# EAGLE design WeatherShield_Base (EAGLE 7.3.0)
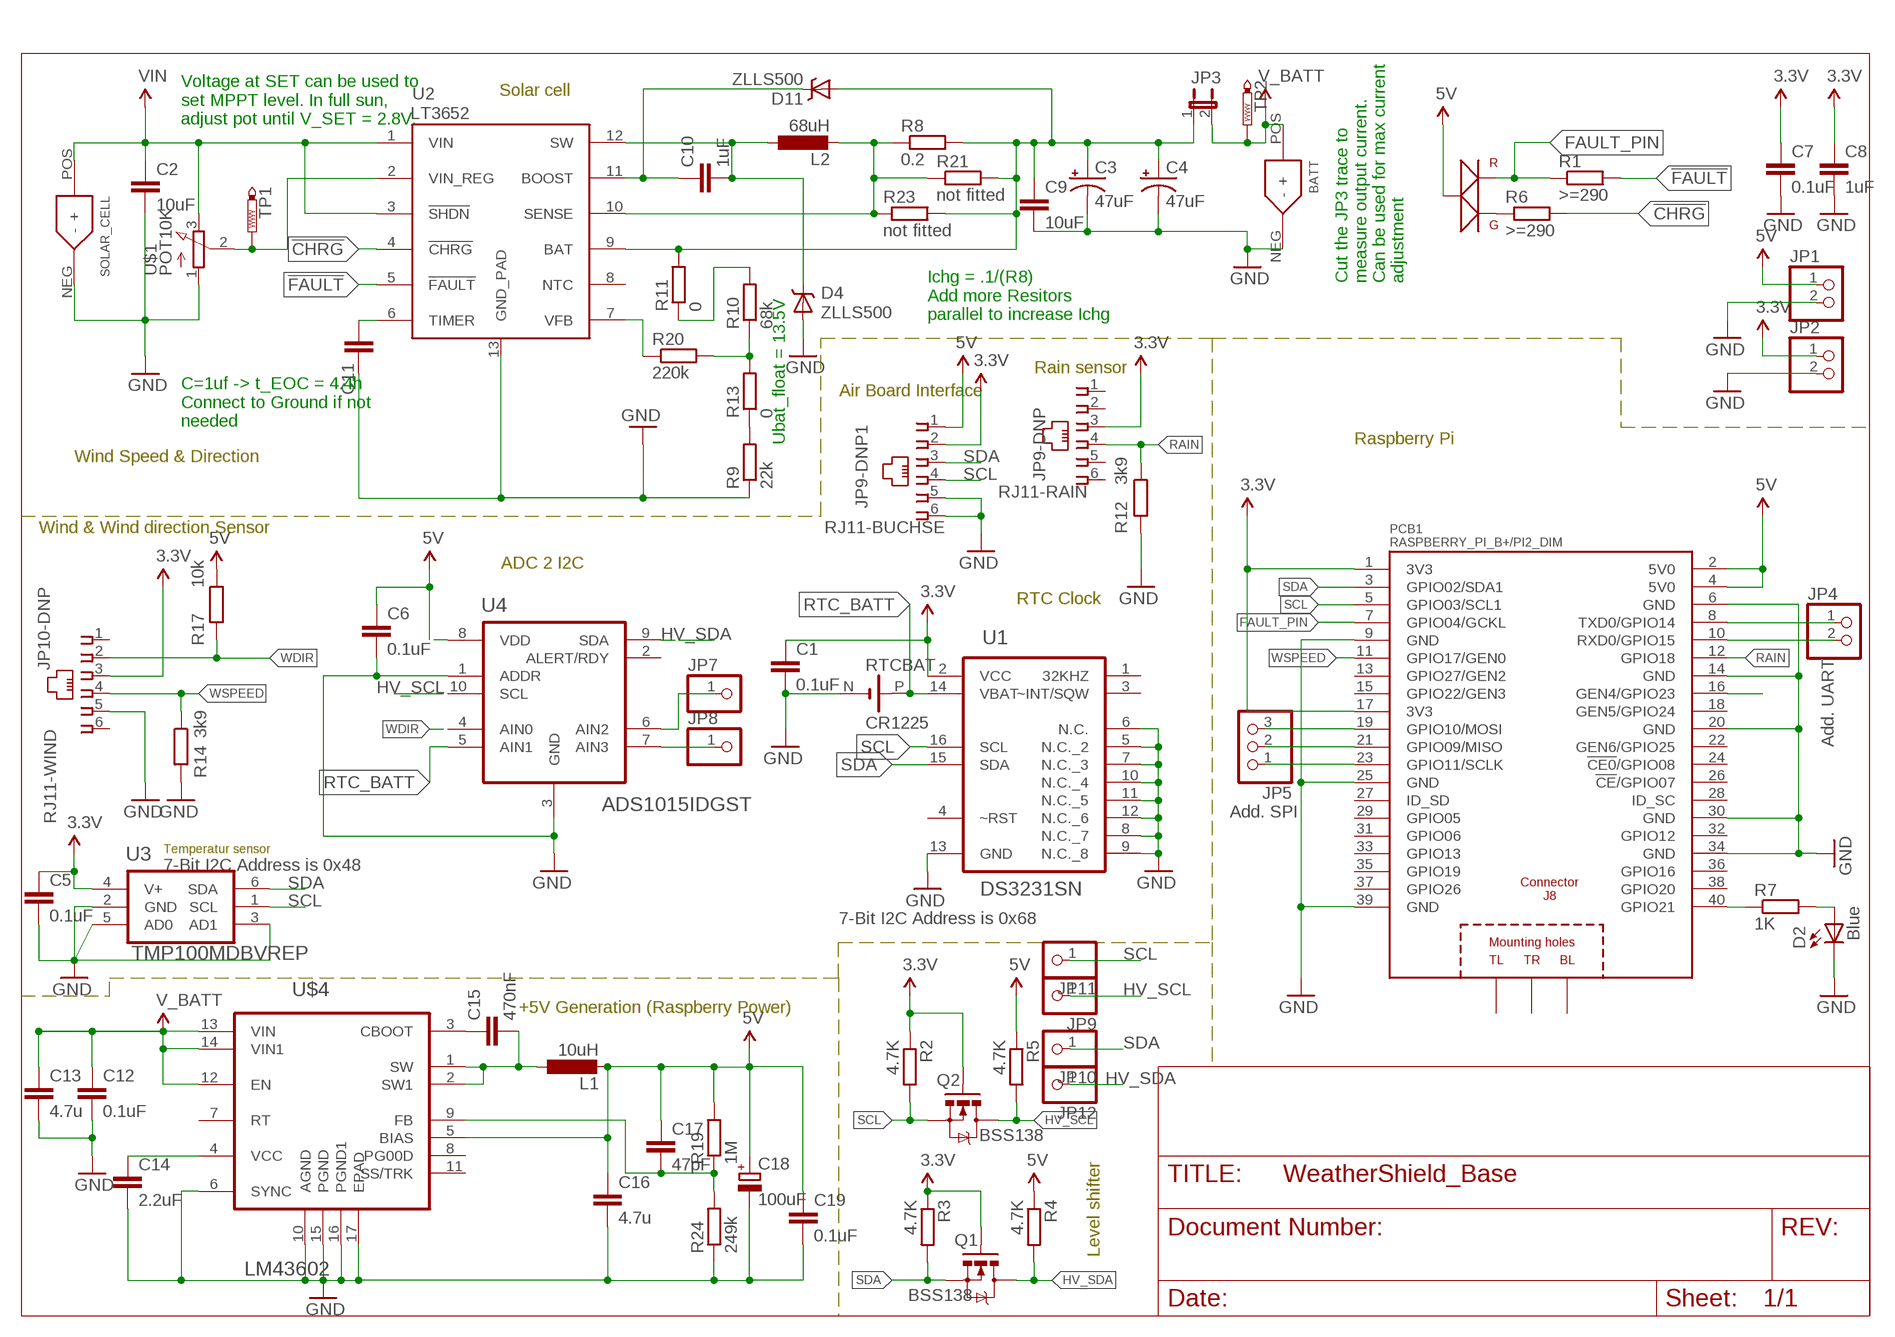
[diagram p0: schematic, sheet 1]

## Parts
BATT  XT-60  [XT-60]
C1  0.1uF  C-EUC0603  [C0603]
C2  10uF  C-EUC0603  [C0603]
C3  47uF  47UF-16V-10%(TANT)  [EIA7343-20]
C4  47uF  47UF-16V-10%(TANT)  [EIA7343-20]
C5  0.1uF  C-EUC0603  [C0603]
C6  0.1uF  C-EUC0603  [C0603]
C7  0.1uF  C-EUC0603  [C0603]
C8  1uF  C-EUC0603  [C0603]
C9  10uF  C-EUC0603  [C0603]
C10  1uF  C-EUC0603  [C0603]
C11  1.0uF  C-EUC0603  [C0603]
C12  0.1uF  C-EUC1206  [C1206]
C13  4.7u  C-EUC1206  [C1206]
C14  2.2uF  C-EUC0603  [C0603]
C15  470nF  C-EUC0603  [C0603]
C16  4.7u  C-EUC0603  [C0603]
C17  47pF  C-EUC0603  [C0603]
C18  100uF  CPOL-EUE2,5-6E  [E2,5-6E]
C19  0.1uF  C-EUC1206  [C1206]
D2  Blue  LED0603  [LED-0603]
D4  ZLLS500  ZLLS500ZLLS500  [SOT23]
D11  ZLLS500  ZLLS500ZLLS500  [SOT23]
JP1  PINHD-1X2  [1X02]
JP2  PINHD-1X2  [1X02]
JP3  JUMPER-PTH-2-NC  [PTH-JUMPER-NC_BOTTOM_NO_SILK]
JP4  PINHD-1X2  [1X02]
JP5  PINHD-1X3  [1X03]
JP7  PINHD-1X1  [1X01]
JP8  PINHD-1X1  [1X01]
JP9  PINHD-1X1  [1X01]
JP9-DNP  RJ11-RAIN  RJ11-BUCHSE  [RJ11-STECKER]
JP9-DNP1  RJ11-BUCHSE  [RJ11-STECKER]
JP10  PINHD-1X1  [1X01]
JP10-DNP  RJ11-WIND  RJ11-BUCHSE  [RJ11-STECKER]
JP11  PINHD-1X1  [1X01]
JP12  PINHD-1X1  [1X01]
L1  10uH  L-EU6000-XXX-RC  [6000-XXXX-RC]
L2  68uH  L-EU6000-XXX-RC  [6000-XXXX-RC]
PCB1  RASPBERRY_PI_B+/PI2_DIM  [RASPBERRY_PI_BPLUS_DIM]
Q1  BSS138  MOSFET-NCHANNELSMD  [SOT23-3]
Q2  BSS138  MOSFET-NCHANNELSMD  [SOT23-3]
R1  >=290  R-EU_R0603  [R0603]
R2  4.7K  R-EU_R0603  [R0603]
R3  4.7K  R-EU_R0603  [R0603]
R4  4.7K  R-EU_R0603  [R0603]
R5  4.7K  R-EU_R0603  [R0603]
R6  >=290  R-EU_R0603  [R0603]
R7  1K  R-EU_R0603  [R0603]
R8  0.2  R-EU_R0805  [R0805]
R9  22k  R-EU_R0603  [R0603]
R10  68k  R-EU_R0603  [R0603]
R11  0  R-EU_R0603  [R0603]
R12  3k9  R-EU_R0603  [R0603]
R13  0  R-EU_R0603  [R0603]
R14  3k9  R-EU_R0603  [R0603]
R17  10k  R-EU_R0603  [R0603]
R19  1M  R-EU_R0805  [R0805]
R20  220k  R-EU_R0603  [R0603]
R21  not fitted  R-EU_R0805  [R0805]
R23  not fitted  R-EU_R0805  [R0805]
R24  249k  R-EU_R0805  [R0805]
RTCBAT  CR1225  BATTERIE_HALTER_CR1225  [BATTERIE_HALTER_CR1225]
SOLAR_CELL  XT-60  [XT-60]
TP1  SET  PTR1B1,27  [B1,27]
TP2  SET  PTR1B1,27  [B1,27]
U1  DS3231SN  [SOIC127P1032X265-16N]
U2  LT3652  [MSOP-12_GND]
U3  TMP100MDBVREP  [SOT95P280X145-6N]
U4  ADS1015IDGST  [SOP50P490X110-10N]
U$1  POT10K  POT_TS63Y_10K  [POT_TS63Y_10K]
U$3  VLMV3100  [VLMV3100]
U$4  LM43602  [HTSSOP-16]

## Nets
3.3V: C1.1 C5.1 C7.1 C8.1 JP2.1 JP9-DNP1.2 JP9-DNP.3 JP10-DNP.3 PCB1.1(3V3) PCB1.17(3V3) Q1.1(G) Q2.1(G) R2.1 R3.1 U1.2(VCC) U3.4(V+)
5V: C6.1 C16.1 C17.1 C18.+ C19.1 JP1.1 JP9-DNP1.1 L1.2 PCB1.2(5V0) PCB1.4(5V0) R4.1 R5.1 R17.1 R19.2 U4.8(VDD) U$3.C U$4.5(BIAS)
!CHRG: R6.2 U2.4(!CHRG)
!FAULT: R1.2 U2.5(!FAULT)
BOOST: C10.1 D11.3(C) U2.11(BOOST)
FAULT_PIN: PCB1.7(GPIO04/GCKL) R1.1 U$3.A_RED
FB: R10.1 R13.2 R20.2
GND [vcc]: BATT.NEG(-) C1.2 C2.2 C3.C(-) C4.C(-) C5.2 C6.2 C7.2 C8.2 C9.2 C11.1 C12.2 C13.2 C14.2 C16.2 C18.- C19.2 D2.C D4.1(A) JP1.2 JP2.2 JP9-DNP1.5 JP9-DNP1.6 JP10-DNP.5 PCB1.6(GND) PCB1.9(GND) PCB1.14(GND) PCB1.20(GND) PCB1.25(GND) PCB1.30(GND) PCB1.34(GND) PCB1.39(GND) R9.1 R12.2 R14.2 R24.1 RTCBAT.N(-) SOLAR_CELL.NEG(-) U1.5(N.C._2) U1.6(N.C.) U1.7(N.C._3) U1.8(N.C._7) U1.9(N.C._8) U1.10(N.C._4) U1.11(N.C._5) U1.12(N.C._6) U1.13(GND) U2.13(GND_PAD) U3.2(GND) U3.3(AD1) U3.5(AD0) U4.1(ADDR) U4.3(GND) U$1.1(A) U$4.6(SYNC) U$4.10(AGND) U$4.15(PGND) U$4.16(PGND1) U$4.17(EPAD)
HV_SCL: JP9.1 Q2.3(D) R5.2 U4.10(SCL)
HV_SDA: JP12.1 Q1.3(D) R4.2 U4.9(SDA)
N$1: R9.2 R13.1
N$2: R10.2 R11.1
N$3: PCB1.16(GEN4/GPIO23)
N$4: R6.1 U$3.A_GREEN
N$8: JP7.1 U4.6(AIN2)
N$9: JP8.1 U4.7(AIN3)
N$10: D2.A R7.2
N$15: R20.1 U2.7(VFB)
N$16: C3.A(+) C4.A(+) C9.1 D11.1(A) JP3.1 R8.2 R11.2 R21.2 R23.2 U2.9(BAT)
N$17: C15.1 U$4.3(CBOOT)
N$18: JP4.1 PCB1.8(TXD0/GPIO14)
N$19: JP4.2 PCB1.10(RXD0/GPIO15)
N$20: JP5.3 PCB1.19(GPIO10/MOSI)
N$21: JP5.2 PCB1.21(GPIO09/MISO)
N$22: C17.2 R19.1 R24.2 U$4.9(FB)
N$23: C14.1 U$4.4(VCC)
N$24: C15.2 L1.1 U$4.1(SW) U$4.2(SW1)
N$25: JP5.1 PCB1.23(GPIO11/SCLK)
RAIN: JP9-DNP.4 PCB1.12(GPIO18) R12.1
RTC_BATT: RTCBAT.P(+) U1.14(VBAT) U4.5(AIN1)
SCL: JP9-DNP1.4 JP11.1 PCB1.5(GPIO03/SCL1) Q2.2(S) R2.2 U1.16(SCL) U3.1(SCL)
SDA: JP9-DNP1.3 JP10.1 PCB1.3(GPIO02/SDA1) Q1.2(S) R3.2 U1.15(SDA) U3.6(SDA)
SENSE: L2.2 R8.1 R21.1 R23.1 U2.10(SENSE)
SET: TP1.TP U2.2(VIN_REG) U$1.2(S)
STAT3: PCB1.40(GPIO21) R7.1
SW: C10.2 D4.3(C) L2.1 U2.12(SW)
TIMER: C11.2 U2.6(TIMER)
V_BATT: BATT.POS(+) C12.1 C13.1 JP3.2 TP2.TP U$4.12(EN) U$4.13(VIN) U$4.14(VIN1)
VIN: C2.1 SOLAR_CELL.POS(+) U2.1(VIN) U2.3(!SHDN) U$1.3(E)
WDIR: JP10-DNP.2 R17.2 U4.4(AIN0)
WSPEED: JP10-DNP.4 PCB1.11(GPIO17/GEN0) R14.1
Unconnected: JP9-DNP.1 JP9-DNP.2 JP9-DNP.5 JP9-DNP.6 JP10-DNP.1 JP10-DNP.6 PCB1.13(GPIO27/GEN2) PCB1.15(GPIO22/GEN3) PCB1.18(GEN5/GPIO24) PCB1.22(GEN6/GPIO25) PCB1.24(!CE0!/GPIO08) PCB1.26(!CE!/GPIO07) PCB1.27(ID_SD) PCB1.28(ID_SC) PCB1.29(GPIO05) PCB1.31(GPIO06) PCB1.32(GPIO12) PCB1.33(GPIO13) PCB1.35(GPIO19) PCB1.36(GPIO16) PCB1.37(GPIO26) PCB1.38(GPIO20) PCB1.PE_BL(BL) PCB1.PE_TL(TL) PCB1.PE_TR(TR) U1.1(32KHZ) U1.3(~INT/SQW) U1.4(~RST) U2.8(NTC) U4.2(ALERT/RDY) U$4.7(RT) U$4.8(PG00D) U$4.11(SS/TRK)

## Notes on the sheet
- Solar cell
- Voltage at SET can be used to
  set MPPT level. In full sun,
  adjust pot until V_SET = 2.8V.
- Cut the JP3 trace to
  measure output current.
  Can be used for max current
  adjustment
- Ichg = .1/(R8)
  Add more Resitors 
  parallel to increase Ichg
- Rain sensor
- Air Board Interface
- C=1uf -> t_EOC = 4.4h
  Connect to Ground if not 
  needed
- Ubat_float = 13.5V | Raspberry Pi
- Wind Speed & Direction
- Wind & Wind direction Sensor
- ADC 2 I2C
- RTC Clock
- Add. UART
- Add. SPI
- Temperatur sensor
- 7-Bit I2C Address is 0x48
- 7-Bit I2C Address is 0x68
- +5V Generation (Raspberry Power)
- Level shifter

## Library data of the parts
BATT SOLAR_CELL = FSEWeatherShield:XT-60
C1 C2 C5-C17 C19 = rcl:C-EU: CAPACITOR, European symbol
C3 C4 = FSEWeatherShield:47UF-16V-10%(TANT)
C18 = rcl:CPOL-EU: POLARIZED CAPACITOR, European symbol
D2 = SparkFun:LED: LEDs Standard schematic elements and footprints for 5mm, 3mm, 1206, and 0603 sized LEDs. 5mm - Spark Fun Electronics SKU : COM-00529 (and others)
D4 D11 = SparkFun-DiscreteSemi:ZLLS500: 700mA 40V SOT-23 Schottky; PROD_ID: DIO-08411
JP1 JP2 JP4 = pinhead:PINHD-1X2: PIN HEADER
JP3 = SparkFun-Passives:JUMPER-PTH-2-NC
JP5 = pinhead:PINHD-1X3: PIN HEADER
JP7-JP12 = pinhead:PINHD-1X1: PIN HEADER
JP9-DNP JP9-DNP1 JP10-DNP = FSEWeatherShield:RJ11-BUCHSE
L1 L2 = rcl:L-EU: INDUCTOR, European symbol
PCB1 = FSE_Weather_Shield:RASPBERRY_PI_B+/PI2: Raspberry Pi B+ Basedon issue: Thursday, July 10, 2014 - Rev 1.2 LBR by Tim Rettmann 07-2014
Q1 Q2 = SparkFun:MOSFET-NCHANNEL
R1-R14 R17 R19-R21 R23 R24 = rcl:R-EU_: RESISTOR, European symbol
RTCBAT = FSEWeatherShield:BATTERIE_HALTER_CR1225
TP1 TP2 = testpad:PTR1: TEST PIN
U1 = FSE_Weather_Shield:DS3231SN: Extremely Accurate I2C-Integrated RTC/TCXO/Crystal; MPN: DS3231SN#; OC_FARNELL: 1593292; OC_NEWARK: 68K3406; PACKAGE: SOIC-16; SUPPLIER: Maxim
U2 = SparkFun-PowerIC:LT3652: LT3652 MPPT Solar Charge Controller 5V-32V smart charger for batteries up to 14.4V
U3 = FSEWeatherShield:TMP100MDBVREP: DIGITAL TEMPERATURE SENSOR WITH I2C INTERFACE; MPN: TMP100MDBVREP; OC_FARNELL: 1715202; OC_NEWARK: 46M1069; PACKAGE: SOT-23-6; SUPPLIER: Texas Instruments
U4 = FSEWeatherShield:ADS1015IDGST: Ultra-Small, Low-Power, 12-Bit Analog-to-Digital Converter with Internal Reference; MPN: ADS1015IDGST; OC_FARNELL: 1778211; OC_NEWARK: 35R0211; PACKAGE: MSOP-10; SUPPLIER: Texas Instruments
U$1 = FSEWeatherShield:POT_TS63Y_10K
U$3 = FSEWeatherShield:VLMV3100
U$4 = FSEWeatherShield:LM43602

## Net classes
1 vcc: width 0.203 mm

## Board
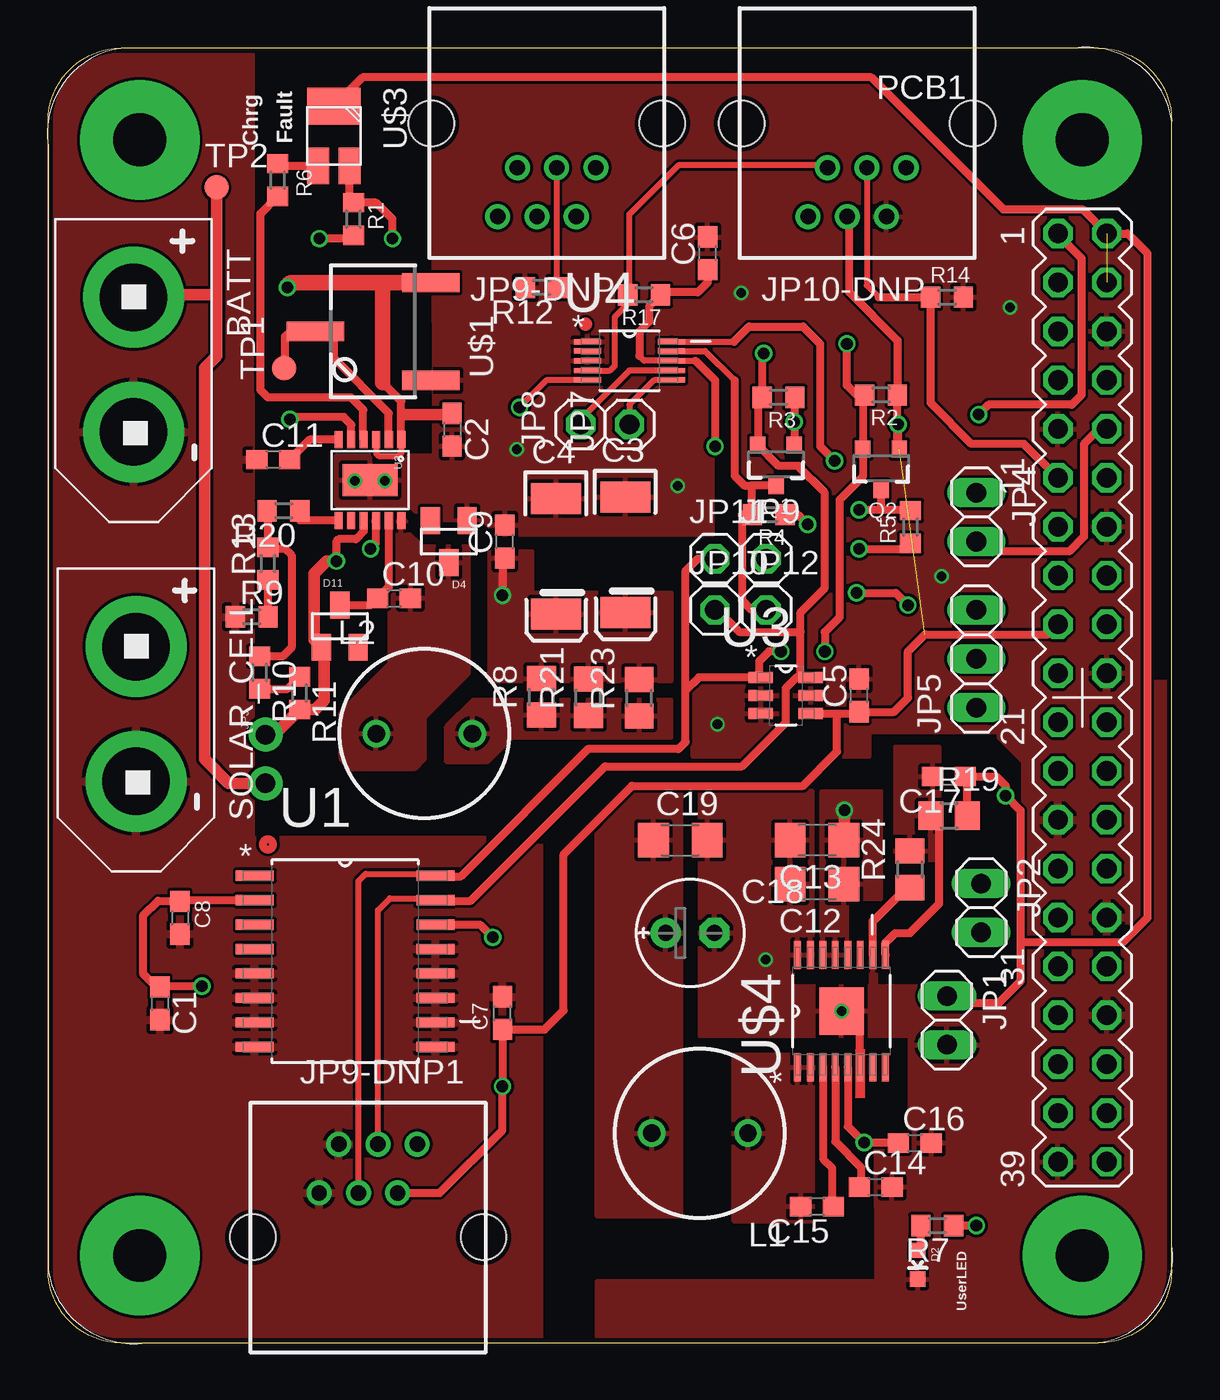
[diagram p1: board, top side]
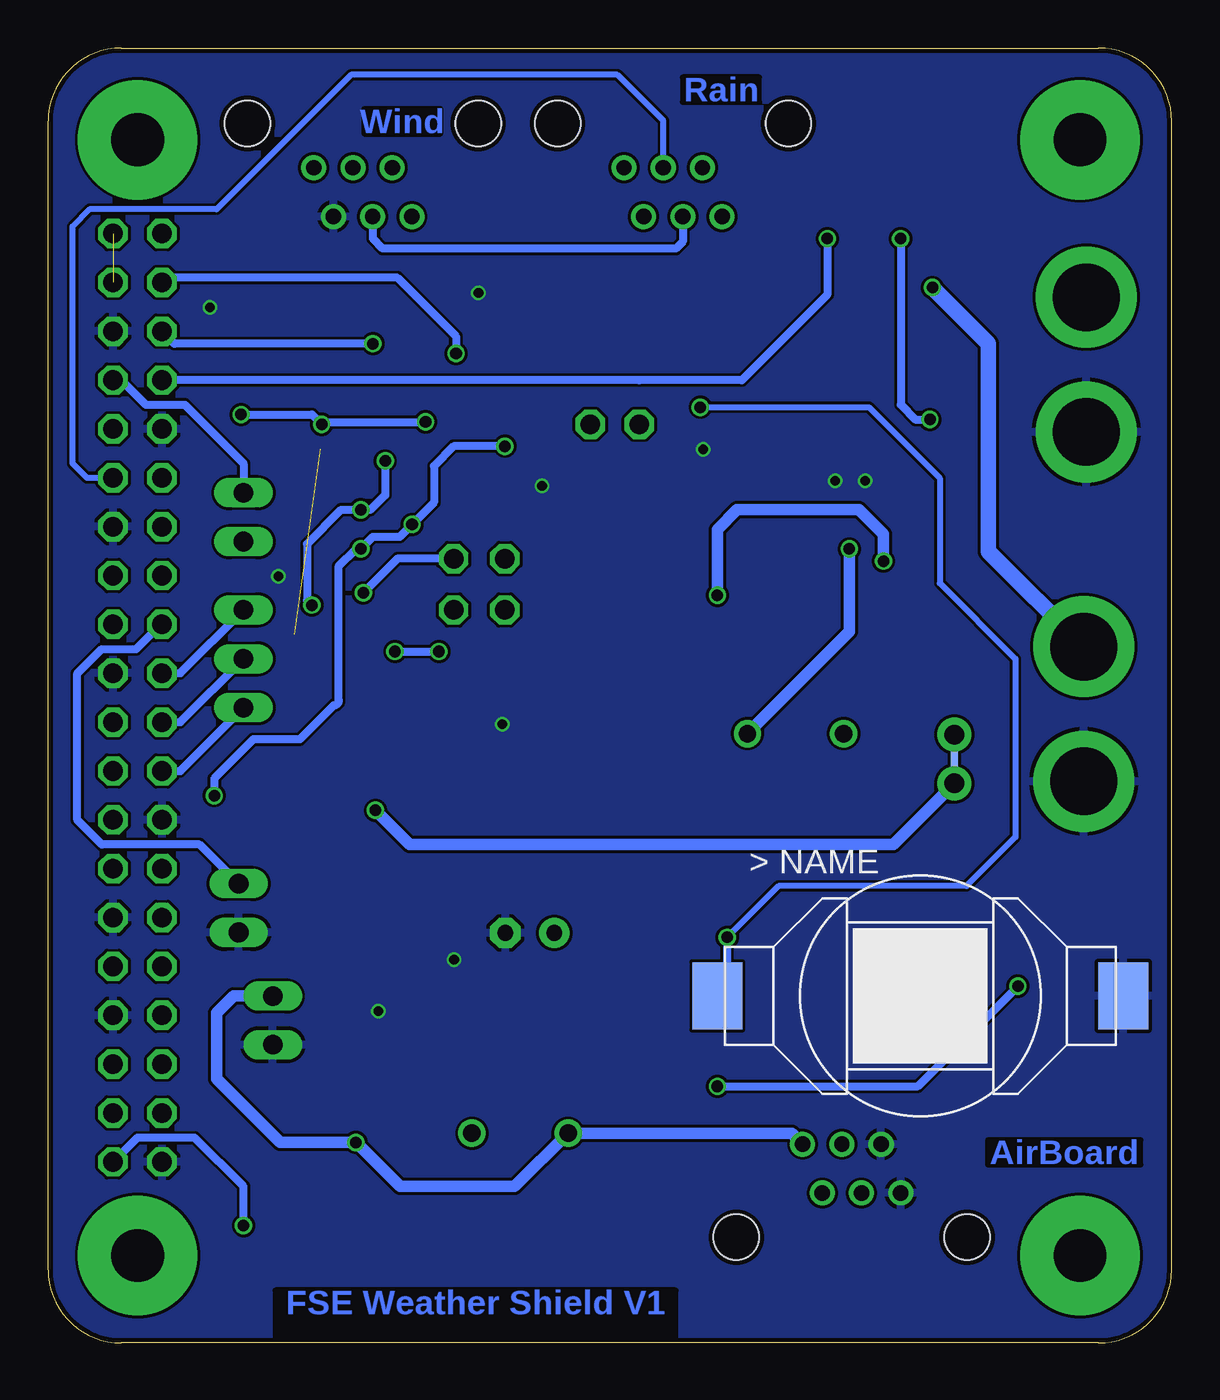
[diagram p2: board, bottom side, seen from below]

Size 58.42 x 67.31 mm. Coordinates in mm from the lower left corner, seen from the top.
Outline: 54.61,67.31 arc-90 58.42,63.5 58.42,3.81 arc-90 54.61,0 3.81,0 arc-90 0,3.81 0,63.5 arc-90 3.81,67.31 54.61,67.31
Copper layers (1*16): Top 0.018mm / dielectric 1.55mm / Bottom 0.018mm
Design rules "eC_2Layer_PClass6_BaseCopperO18_eCDefault": minimum track width 0.15mm, minimum drill 0.35mm, track to track 0.15mm, track to pad 0.15mm, pad to pad 0.15mm, via to via 0.15mm, smd to smd 0mil, copper to edge 0.25mm, drill to drill 0.35mm, minimum pad ring 0.175mm, minimum via ring 0.125mm, stop-mask expansion 0mil, vias tented up to drill 0.45mm, thermal gap 0.2mm

### Footprints (pad centres in the part's own frame; a part is rotated, then mirrored left to right if it is on the bottom)
XT-60 = drill 3.5: NEG 7,0; POS 0,0
C0603 = smd 1.1 x 1: 1 -0.85,0; 2 0.85,0
EIA7343-20 = smd 1.6 x 2.6: A 3,0; C -3,0
C1206 = smd 1.6 x 1.8: 1 -1.4,0; 2 1.4,0
E2,5-6E = drill 0.813 pad 1.575: + -1.27,0 | drill 0.813 pad 1.575 octagon: - 1.27,0
LED-0603 = smd 0.8 x 0.8: A 0,-0.75; C 0,0.75
SOT23 = smd 1 x 1.4: 1 -0.95,-1.1; 2 0.95,-1.1; 3 0,1.1
1X02 = drill 1.016 long: 1 -1.27,0; 2 1.27,0
PTH-JUMPER-NC_BOTTOM_NO_SILK = drill 1.016 pad 1.778: 1 -1.27,0; 2 1.27,0 | smd 1.27 x 0.381 bottom: P$1 0,0
1X03 = drill 1.016 long: 1 -2.54,0; 2 0,0; 3 2.54,0
1X01 = drill 1.016 octagon: 1 0,0
RJ11-STECKER = drill 0.8 pad 1.3: 1 8.65,10.84; 2 7.63,8.3; 3 6.61,10.84; 4 5.59,8.3; 5 4.57,10.84; 6 3.55,8.3 | hole 2.36: 0.1,6; 12.1,6
6000-XXXX-RC = drill 0.9 pad 1.422: 1 -2.5,0; 2 2.5,0
RASPBERRY_PI_BPLUS_DIM = drill 1.016 octagon: 1 9.64,52.5; 2 9.64,55.04; 3 12.18,52.5; 4 12.18,55.04; 5 14.72,52.5; 6 14.72,55.04; 7 17.26,52.5; 8 17.26,55.04; 9 19.8,52.5; 10 19.8,55.04; 11 22.34,52.5; 12 22.34,55.04; 13 24.88,52.5; 14 24.88,55.04; 15 27.42,52.5; 16 27.42,55.04; 17 29.96,52.5; 18 29.96,55.04; 19 32.5,52.5; 20 32.5,55.04; 21 35.04,52.5; 22 35.04,55.04; 23 37.58,52.5; 24 37.58,55.04; 25 40.12,52.5; 26 40.12,55.04; 27 42.66,52.5; 28 42.66,55.04; 29 45.2,52.5; 30 45.2,55.04; 31 47.74,52.5; 32 47.74,55.04; 33 50.28,52.5; 34 50.28,55.04; 35 52.82,52.5; 36 52.82,55.04; 37 55.36,52.5; 38 55.36,55.04; 39 57.9,52.5; 40 57.9,55.04 | drill 2.75 pad 6.2: PE_BL 4.77,4.77; PE_TL 4.77,53.77; PE_TR 62.77,53.77; PE_TR1 62.77,4.77
SOT23-3 = smd 0.8 x 0.9: 1 -0.95,-1; 2 0.95,-1; 3 0,1.1
R0603 = smd 1 x 1.1: 1 -0.85,0; 2 0.85,0
R0805 = smd 1.3 x 1.5: 1 -0.95,0; 2 0.95,0
BATTERIE_HALTER_CR1225 = smd 2.6 x 3.5: N 10.55,0; P -10.55,0
B1,27 = smd 1.27 x 1.27: TP 0,0
SOIC127P1032X265-16N = smd 1.981 x 0.533: 1 -4.699,4.445; 2 -4.699,3.175; 3 -4.699,1.905; 4 -4.699,0.635; 5 -4.699,-0.635; 6 -4.699,-1.905; 7 -4.699,-3.175; 8 -4.699,-4.445; 9 4.699,-4.445; 10 4.699,-3.175; 11 4.699,-1.905; 12 4.699,-0.635; 13 4.699,0.635; 14 4.699,1.905; 15 4.699,3.175; 16 4.699,4.445
MSOP-12_GND = smd 0.889 x 0.42: 1 -2.1,1.625; 2 -2.1,0.975; 3 -2.1,0.325; 4 -2.1,-0.325; 5 -2.1,-0.975; 6 -2.1,-1.625; 7 2.1,-1.625; 8 2.1,-0.975; 9 2.1,-0.325; 10 2.1,0.325; 11 2.1,0.975; 12 2.1,1.625 | smd 1.651 x 2.845: 13 0,0
SOT95P280X145-6N = smd 1.27 x 0.559: 1 -1.295,0.94; 2 -1.295,0; 3 -1.295,-0.94; 4 1.295,-0.94; 5 1.295,0; 6 1.295,0.94
SOP50P490X110-10N = smd 1.422 x 0.279: 1 -2.184,0.991; 2 -2.184,0.508; 3 -2.184,0; 4 -2.184,-0.508; 5 -2.184,-0.991; 6 2.184,-0.991; 7 2.184,-0.508; 8 2.184,0; 9 2.184,0.508; 10 2.184,0.991
POT_TS63Y_10K = smd 3 x 1: 1 3,-2.54; 2 -3,0; 3 3,2.54
VLMV3100 = smd 1.9 x 1.15: A_GREEN 1.55,-0.825; A_RED 1.55,0.825 | smd 1.9 x 2.8: C -1.55,0
HTSSOP-16 = smd 1.473 x 0.356: 1 -2.921,2.286; 2 -2.921,1.626; 3 -2.921,0.965; 4 -2.921,0.33; 5 -2.921,-0.33; 6 -2.921,-0.965; 7 -2.921,-1.626; 8 -2.921,-2.286; 9 2.921,-2.286; 10 2.921,-1.626; 11 2.921,-0.965; 12 2.921,-0.33; 13 2.921,0.33; 14 2.921,0.965; 15 2.921,1.626; 16 2.921,2.286 | smd 2.464 x 2.311: 17 0,0

### Placement (x,y rotation side)
BATT  4.45,54.36 270 top
C1  5.82,17.65 270 top
C2  21.01,47.47 270 top
C3  30.02,40.97 270 top
C4  26.42,40.89 270 top
C5  42.16,33.66 90 top
C6  34.29,56.64 90 top
C7  23.62,17.15 90 top
C8  6.86,22.1 270 top
C9  23.75,41.66 90 top
C10  17.98,38.71 0 top
C11  11.71,45.92 0 top
C12  39.98,23.85 180 top
C13  39.98,26.14 180 top
C14  43.03,8.1 0 top
C15  39.98,7.09 180 top
C16  45.06,10.39 0 top
C17  46.84,29.44 180 top
C18  33.38,21.31 0 top
C19  32.87,26.14 0 top
D2  45.21,4.06 180 top
D4  20.83,41.66 180 top
D11  15.16,37.26 0 top
JP1  46.74,16.76 270 top
JP2  48.51,22.61 270 top
JP3  11.3,30.35 270 top
JP4  48.26,42.93 270 top
JP5  48.26,35.56 90 top
JP7  30.23,47.75 90 top
JP8  27.69,47.75 90 top
JP9  37.34,40.77 0 top
JP9-DNP  32.03,69.39 180 top
JP9-DNP1  10.54,-0.51 0 top
JP10  34.67,38.1 0 top
JP10-DNP  48.16,69.39 180 top
JP11  34.67,40.77 0 top
JP12  37.34,38.1 0 top
L1  33.88,10.9 180 top
L2  19.56,31.67 0 top
PCB1  0,67.31 270 top
Q1  37.85,45.67 180 top
Q2  43.31,45.47 180 top
R1  15.88,58.42 270 top
R2  43.31,49.28 180 top
R3  37.97,49.15 180 top
R4  37.46,43.05 180 top
R5  44.83,42.42 90 top
R6  11.94,60.45 270 top
R7  46.23,6.1 180 top
R8  25.65,33.58 90 top
R9  10.59,37.74 0 top
R10  11,34.85 270 top
R11  13.08,33.78 270 top
R12  25.65,54.86 180 top
R13  11.43,40.51 90 top
R14  46.74,54.36 0 top
R17  30.99,54.48 180 top
R19  46.84,27.41 0 top
R20  12.24,43.26 180 top
R21  28.09,33.55 90 top
R23  30.73,33.53 90 top
R24  44.81,24.61 90 top
RTCBAT  13.08,18.03 0 bottom
SOLAR_CELL  4.57,36.2 270 top
TP1  12.27,50.67 90 top
TP2  8.76,60.07 0 top
U1  15.44,19.84 0 top
U2  16.74,44.86 270 top
U3  38.35,33.66 0 top
U4  30.23,51.05 0 top
U$1  16.89,52.58 0 top
U$3  14.86,62.74 270 top
U$4  41.25,17.25 90 top

### Tracks (layer width: path | path; a pad name or v marks a point on that pad's centre or on a via)
3.3V  (via drill 0.6)  (1 unrouted)
  Top 0.406: R3.1 38.8,49.12 v38.8,47.88 Q1.1 | v44.2,47.75 44.2,46.65 Q2.1 44.16,46.69 R2.1 44.16,52.11 41.66,54.61 41.66,58.45 JP10-DNP.3 41.53,58.53 | U3.4 41.02,32.72 | 41.02,32.72 42.07,32.72 C5.1 43.98,32.8 44.7,33.53 44.7,35.94 45.59,36.83 51.98,36.83 PCB1.17 | 41.02,32.72 41.02,30.73 39.24,28.96 30.35,28.96 26.8,25.4 26.8,17.27 25.82,16.3 C7.1 v23.62,13.34 23.62,11.05 20.36,7.79 JP9-DNP1.2 | U1.2 6.86,23.01 C8.1 6.82,22.99 5.71,22.99 4.95,22.23 4.95,19.18 5.63,18.5 C1.1 5.86,18.54 v8,18.54 | PCB1.1 52.5,57.61 53.72,56.39 53.72,49.28 53.21,48.77 48.89,48.77 v48.39,48.26
  Bottom 0.406: JP2.1 50.55,25.91 55.63,25.91 56.9,27.18 56.9,34.8 55.63,36.07 53.85,36.07 52.57,37.35 PCB1.17 | v38.8,47.88 44.07,47.88 v44.2,47.75 44.7,48.26 v48.39,48.26 | v23.62,13.34 13.21,13.34 v8,18.54 | JP9-DNP.3 25.42,57.26 25.78,56.9 41.02,56.9 41.53,57.4 41.53,58.53 JP10-DNP.3
5V  (via drill 0.6)  (1 unrouted)
  Top 0.305: 30.73,51.31 30.99,51.05 U4.8 33.66,51.05
  Top 0.406: R19.2 47.79,29.34 C17.1 49.3,29.44 49.78,28.96 v49.78,28.45 50.55,27.69 50.55,20.83 | U$4.5 41.58,11.25 v42.42,10.41 44.18,10.41 C16.1 | 50.55,20.83 50.55,18.8 49.4,17.65 47.12,17.65 JP1.1 | 50.55,20.83 55.88,20.83 57.15,22.1 57.15,56.64 56.12,57.67 PCB1.2 53.78,58.93 49.66,58.93 42.8,65.79 16.36,65.79 U$3.C | C6.1 34.29,55.12 33.78,54.61 31.96,54.61 R17.1 31.24,53.89 31.24,53.09 30.73,52.58 30.73,51.31 | 33.66,51.05 34.67,50.04 v34.67,46.61 | R4.1 38.99,43.05 v39.5,42.55 | v42.16,41.27 44.54,41.27 R5.1
  Bottom 0.406: 31.5,10.78 L1.2 | v49.78,28.45 49.78,29.34 47.75,31.37 45.34,31.37 43.56,33.15 arc-90 43.31,33.4 43.31,40.39 42.42,41.27 v42.16,41.27 41.53,41.91 40.13,41.91 v39.5,42.55 38.35,43.69 38.35,45.59 37.34,46.61 v34.67,46.61
  Bottom 0.61: JP9-DNP1.1 19.76,10.9 L1.2 34.16,8.13 40.13,8.13 v42.42,10.41 46.35,10.41 49.66,13.72 49.66,17.15 48.77,18.03 JP1.1
  pour Top: 32.87,28.68 32.87,6.58 28.55,6.58 28.55,28.68
!CHRG
  Top 0.406: U2.4 16.38,46.99 16.38,48.51 15.75,49.15 11.43,49.15 11.05,49.53 11.05,58.71 R6.2
!FAULT  (via drill 0.6)
  Top 0.406: U2.5 15.76,47.74 15.37,48.13 12.7,48.13 v12.57,48.01 | R1.2 15.71,57.4 v14.1,57.4
  Bottom 0.406: v14.1,57.4 14.1,48.77 13.33,48.01 v12.57,48.01
BOOST
  Top 0.406: U2.11 17.71,39.29 C10.1 16.79,38.36 D11.3
FAULT_PIN  (via drill 0.6)
  Top 0.406: v17.91,57.4 17.91,58.42 17.06,59.27 R1.1 15.68,59.46 U$3.A_RED
  Top 0.61: U$3.A_RED 15.8,61.3
  Bottom 0.406: 27.55,50.05 27.69,50.05 | 27.69,50.05 PCB1.7 | 27.69,50.05 27.67,50.04 22.35,50.04 17.91,54.48 v17.91,57.4
FB
  Top 0.406: R20.2 11.43,43.22 R13.2 11.52,41.27 12.32,41.27 12.65,40.95 12.65,36.14 12.19,35.69 11.01,35.69 R10.1
GND  (via drill 0.5 pad 0.25)
  Top 0.406: U$4.6 42.21,16.79 41.76,17.25 U$4.17 | U$4.10 42.88,21.92 44.62,23.66 R24.1
  other vias: 41.25,17.25 37.31,19.91 17.5,44.81 50.01,53.82 32.74,44.55 36.04,54.58 34.8,32.16 15.95,44.81 24.36,46.46 46.46,39.85
  pour Bottom: 58.42,0 0,0 0,67.31 58.42,67.31
  pour Top: 39.73,19.53 39.73,28.68 33.88,28.68 33.88,15.98 44.81,15.98 44.81,10.64 43.03,10.77 43.05,3.17 28.55,3.2 28.55,0.23 58.65,0.23 58.65,18.52 43.03,18.52 43.03,19.53 42.77,19.53 42.77,18.52 38.71,18.52 38.71,19.53
  pour Top: 14.99,46.1 14.99,43.56 18.8,43.56 19.56,42.8 22.61,42.8 23.37,42.04 34.54,42.04 34.54,53.59 30.99,53.47 20.07,53.47 20.07,46.1
  pour Top: 33.53,30.48 33.53,51.05 23.62,51.05 23.62,53.09 20.07,53.09 20.07,67.31 58.42,67.06 58.42,31.75 42.67,31.75 42.67,30.48
  pour Top: 50.8,17.02 50.8,30.23 49.53,31.5 49.53,34.29 58.17,34.29 58.17,17.02
  pour Top: -0.13,67.31 10.54,67.31 10.54,26.16 25.53,26.16 25.53,0 -0.13,0
HV_SCL  (via drill 0.6)
  Top 0.305: 32.41,52.07 U4.10 35.66,52.05 | 44.79,43.31 R5.2
  Top 0.406: 35.66,52.05 36.45,52.83 39.24,52.83 40.13,51.94 40.13,46.61 v40.89,45.85 | v42.16,43.31 43.31,43.31 | 43.31,43.31 44.79,43.31 | Q2.3 43.31,43.31 | v42.04,38.99 44.07,38.99 v44.7,38.35
  Bottom 0.406: v40.89,45.85 40.89,44.07 41.66,43.31 v42.16,43.31 43.18,43.31 44.96,41.53 44.96,38.61 v44.7,38.35 | JP9.1 40.26,40.77 v42.04,38.99
HV_SDA
  Top 0.305: U4.9 34.16,51.56 35.69,50.04 | Q1.3 36.58,44.58 36.58,44.57 | 36.58,43.09 R4.2
  Top 0.406: 35.69,50.04 35.69,45.09 36.2,44.58 36.58,44.58 36.58,43.09 | Q1.3 36.58,44.57 | R4.2 36.07,43.05 36.07,38.61 36.58,38.1 JP12.1
N$1
  Top 0.406: R9.2 11.44,39.65 R13.1
N$2
  Top 0.406: R10.2 12.45,34 R11.1
N$4
  Top 0.406: 12.05,61.19 U$3.A_GREEN
  Top 0.61: R6.1 12.05,61.19
N$8
  Top 0.305: U4.6 32.38,50.04 31.5,50.04 30.23,48.77 JP7.1
N$9
  Top 0.305: U4.7 30.23,50.55 27.69,48.01 JP8.1
N$10
  Top 0.406: D2.A 45.38,4.81 R7.2
N$15
  Top 0.406: U2.7 13.09,42.76 R20.1
N$16  (via drill 0.6)
  Top 0.406: 13.84,36.53 D11.1 14.35,36.02 | C9.1 23.62,40.81 v23.62,38.86 | U2.9 16.41,42.2 16,41.78 15.11,41.78 14.99,41.66 v14.99,40.64
  Top 0.61: 13.84,36.53 13.84,40.01 14.48,40.64 v14.99,40.64 | JP3.1 11.77,31.62 R11.2 13.88,32.93 14.35,33.4 14.35,36.02
  Bottom 0.61: v14.99,40.64 14.99,42.04 16.26,43.31 22.61,43.31 23.62,42.29 v23.62,38.86
  pour Top: 32.38,38.99 32.38,34.42 22.99,34.42 22.99,41.15 25.15,41.15 25.15,38.99
N$17
  Top 0.406: U$4.3 40.28,9.58 40.74,9.12 40.74,7.18 C15.1
N$18
  Bottom 0.406: PCB1.8 54.62,50.05 53.34,48.77 51.31,48.77 48.26,45.72 JP4.1
N$19
  Top 0.406: PCB1.10 54.62,47.51 53.85,46.74 53.85,41.91 53.09,41.15 48.77,41.15 JP4.2
N$20
  Bottom 0.406: PCB1.19 51.55,34.81 JP5.3
N$21
  Bottom 0.406: PCB1.21 51.55,32.27 JP5.2
N$22
  Top 0.406: 44.87,25.63 R24.2 | U$4.9 43.54,20.8 44.04,21.31 44.81,21.31 46.33,22.84 46.33,26.97 R19.1
  pour Top: 44.04,25.12 46.33,25.12 46.33,30.96 44.04,30.96
N$23
  Top 0.406: U$4.4 40.92,10.46 42.27,9.12 42.27,8.19 C14.1
N$24
  pour Top: 39.73,14.96 39.73,6.32 35.66,6.32 35.66,14.96
N$25
  Bottom 0.406: PCB1.23 51.55,29.73 JP5.1
RAIN
  Top 0.305: JP9-DNP.4 26.44,54.93 R12.1
  Bottom 0.305: PCB1.12 55.05,44.96 56.39,44.96 57.15,45.72 57.15,58.04 56.26,58.93 49.66,58.93 42.67,65.91 28.83,65.91 26.44,63.52 JP9-DNP.4
RTC_BATT  (via drill 0.6)
  Top 0.305: U4.5 28.04,50.04 25.91,50.04 v24.51,48.64
  Top 0.406: U1.14 22.45,21.74 v23.11,21.08
  Bottom 0.305: v24.51,48.64 15.75,48.64 12.06,44.96 12.06,39.5 8.13,35.56 8.13,26.29 10.67,23.75 20.45,23.75 v23.11,21.08
  Bottom 0.406: RTCBAT.P 23.12,18.54 v23.12,21.08 v23.11,21.08
SCL  (via drill 0.6)
  Top 0.305: JP9-DNP1.4 16.13,24.01 16.51,24.38 20.04,24.38 U1.16
  Top 0.406: U1.16 20.17,24.26 21.46,24.26 28.07,30.86 32.77,30.86 33.15,31.24 33.15,33.91 | v38.1,35.94 37.46,35.94 36.96,35.43 36.96,34.7 U3.1 33.83,34.59 33.15,33.91 | v40.39,35.94 40.39,36.96 41.15,37.72 41.15,43.82 42.36,45.02 Q2.2 42.36,49.18 R2.2 42.04,49.28 41.53,49.78 v41.53,51.94 | 34.42,40.77 JP11.1 33.78,40.77 33.15,40.13 33.15,33.91
  Bottom 0.406: v40.39,35.94 v38.1,35.94 | v41.53,51.94 51.85,51.94 PCB1.5
SDA  (via drill 0.6)
  Top 0.305: JP9-DNP1.3 17.15,22.48 17.78,23.11 20.04,23.11 U1.15
  Top 0.406: v37.21,51.44 37.12,51.35 R3.2 36.9,48.92 Q1.2 37.97,45.59 38.99,45.59 40.39,44.2 40.39,39.24 39.12,37.97 39.12,36.96 | U1.15 20.17,22.99 21.97,22.99 28.96,29.97 36.07,29.97 38.35,32.26 38.35,34.04 38.91,34.59 39.06,34.59 | 39.06,34.59 U3.6 | 39.06,34.59 39.12,34.54 39.12,36.96 | JP10.1 34.67,37.72 35.18,37.72 35.94,36.96 39.12,36.96
  Bottom 0.406: v37.21,51.44 37.21,52.32 40.26,55.37 52.26,55.37 PCB1.3
SENSE  (via drill 0.6)
  Top 0.406: U2.10 17.02,42.71 17.02,41.53 v16.76,41.27
  Bottom 0.61: v16.76,41.27 16.76,36.97 L2.2
  pour Top: 32.38,33.4 22.1,33.4 20.7,32 20.7,30.23 22.86,30.23 24.13,31.5 32.38,31.5
SET
  Top 0.406: 12.32,50.72 12.32,52.32 12.57,52.58 U$1.2 14.73,52.58 14.86,52.45 14.86,51.18 17.71,48.33 U2.2
  Top 0.813: 12.32,50.72 TP1.TP
STAT3  (via drill 0.6)
  Top 0.406: v48.26,6.1 R7.1
  Bottom 0.406: v48.26,6.1 48.26,8.13 50.8,10.67 53.78,10.67 PCB1.40
SW
  pour Top: 18.59,42.7 18.59,42.24 19.43,41.4 21.84,41.4 21.84,34.8 19.56,32.51 19.56,30.35 19.05,29.84 15.75,29.84 15.24,30.35 15.24,32.77 17.78,35.31 17.78,41.27 18.16,41.66 18.16,42.67 18.54,42.67
TIMER
  Top 0.406: U2.6 13.59,46.96 C11.2
V_BATT  (via drill 0.6)
  Top 0.61: v41.4,27.69 41.4,26.16 C13.1 | JP3.2 9.4,29.08 8.13,30.35 8.13,50.67 8.76,51.31 8.76,54.48 | 8.76,54.48 TP2.TP | BATT.POS 4.57,54.48 8.76,54.48
  Bottom 0.61: v41.4,27.69 39.62,25.91 14.48,25.91 JP3.2
  pour Top: 40.23,19.53 40.23,28.68 43.28,28.68 43.28,23.09 41.5,23.09 41.5,19.53
VIN  (via drill 0.6)
  Top 0.305: U2.1 18.36,46.25 18.19,46.08 17.22,46.08 17.07,46.23 U2.3
  Top 0.406: 18.36,47.19 U2.1 18.36,48.13 | 18.36,48.13 18.36,48.95 17.4,49.91 | 18.49,48.26 18.36,48.13 | U2.3
  Top 0.61: C2.1 20.94,48.26 18.49,48.26
  Top 0.813: U$1.3 17.4,55.12 | 17.4,55.12 12.7,55.12 arc90 v12.45,54.86 | 17.4,49.91 17.4,55.12
  Bottom 0.813: v12.45,54.86 9.52,51.94 9.52,41.15 SOLAR_CELL.POS
WDIR
  Top 0.305: JP10-DNP.2 40.41,61.21 32.77,61.21 30.23,58.67 30.23,54.48 R17.2 30.14,54.01 29.46,53.34 29.46,50.8 29.21,50.55 U4.4
WSPEED
  Top 0.305: JP10-DNP.4 42.57,54.97 43.18,54.36
  Top 0.406: 43.18,54.36 R14.1 45.89,48.86 48.01,46.74 50.73,46.74 PCB1.11
(copper drawn outside any net)
  shapes: Top area x1, Top circle x2

### Text on the board
Bottom: Rain | Wind | AirBoard | FSE Weather Shield V1
tPlace: Chrg | Fault | UserLED
tValues: N. Seidle